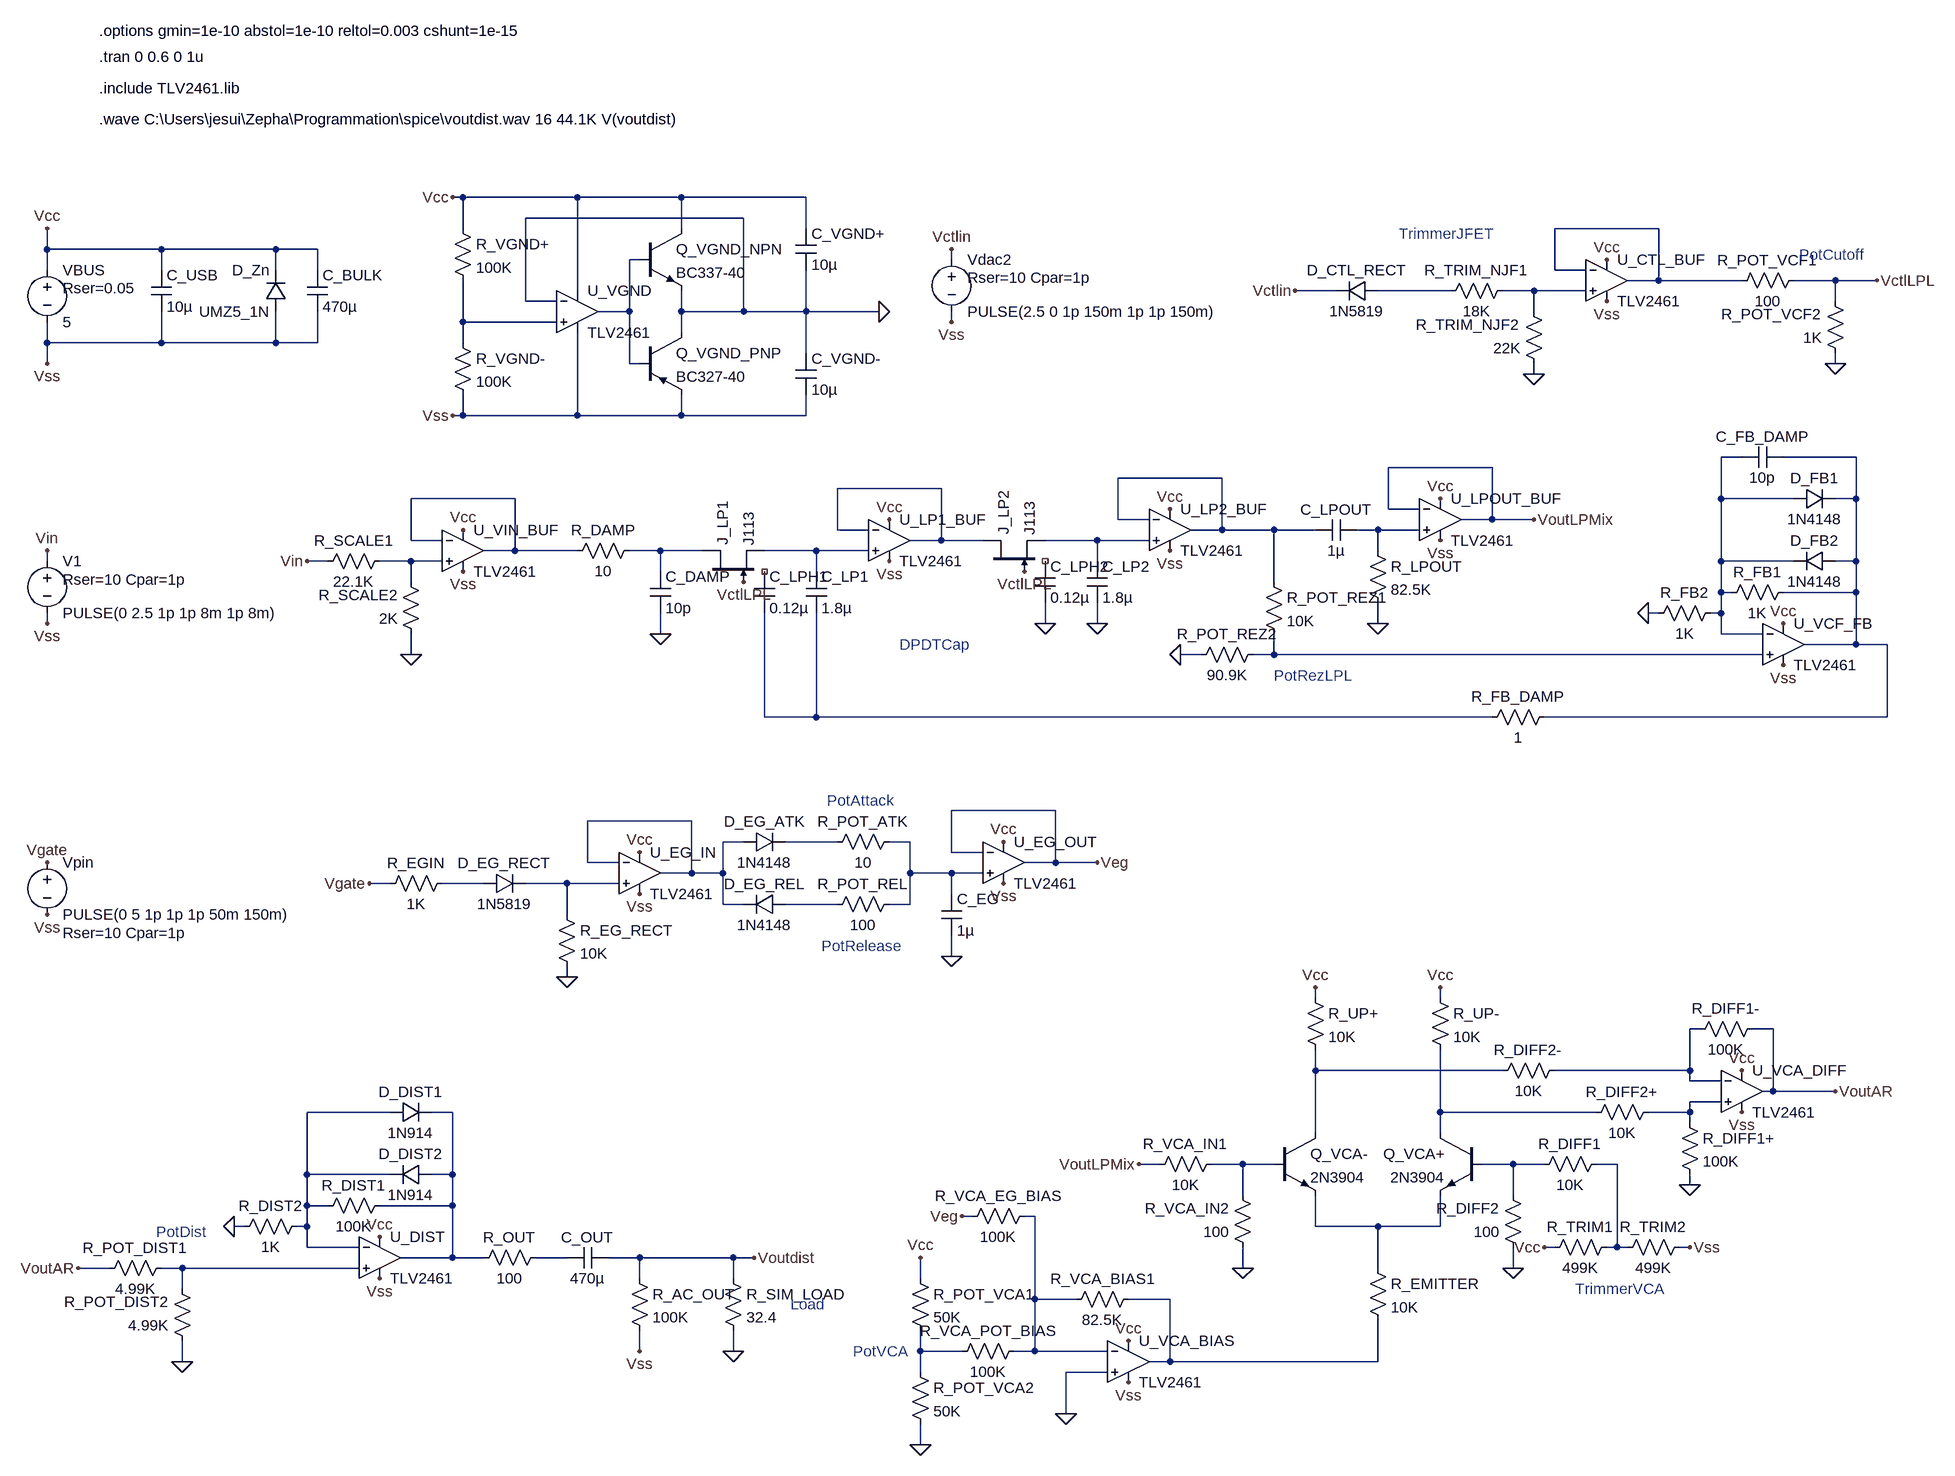
[diagram p0: schematic Heart0.asc]
Heart0.asc, the LTspice schematic file:
Version 4.1
SHEET 1 4584 1604
WIRE 1120 -544 1104 -544
WIRE 1296 -544 1120 -544
WIRE 1456 -544 1296 -544
WIRE 1648 -544 1456 -544
WIRE 1552 -512 1216 -512
WIRE 1120 -496 1120 -544
WIRE 1456 -496 1456 -544
WIRE 1648 -496 1648 -544
WIRE 2960 -496 2800 -496
WIRE 480 -464 480 -496
WIRE 656 -464 480 -464
WIRE 832 -464 656 -464
WIRE 896 -464 832 -464
WIRE 1392 -448 1376 -448
WIRE 1872 -448 1872 -464
WIRE 480 -432 480 -464
WIRE 656 -432 656 -464
WIRE 832 -432 832 -464
WIRE 896 -432 896 -464
WIRE 2800 -432 2800 -496
WIRE 2848 -432 2800 -432
WIRE 2960 -416 2960 -496
WIRE 2960 -416 2912 -416
WIRE 3088 -416 2960 -416
WIRE 3232 -416 3168 -416
WIRE 3296 -416 3232 -416
WIRE 1296 -400 1296 -544
WIRE 2464 -400 2400 -400
WIRE 2640 -400 2528 -400
WIRE 2768 -400 2720 -400
WIRE 2848 -400 2768 -400
WIRE 1216 -384 1216 -512
WIRE 1264 -384 1216 -384
WIRE 3232 -384 3232 -416
WIRE 1376 -368 1376 -448
WIRE 1376 -368 1328 -368
WIRE 1456 -368 1456 -400
WIRE 1552 -368 1552 -512
WIRE 1552 -368 1456 -368
WIRE 1648 -368 1648 -432
WIRE 1648 -368 1552 -368
WIRE 1760 -368 1648 -368
WIRE 2768 -368 2768 -400
WIRE 1120 -352 1120 -416
WIRE 1264 -352 1120 -352
WIRE 1872 -352 1872 -368
WIRE 1456 -336 1456 -368
WIRE 480 -320 480 -352
WIRE 656 -320 656 -368
WIRE 656 -320 480 -320
WIRE 832 -320 832 -368
WIRE 832 -320 656 -320
WIRE 896 -320 896 -368
WIRE 896 -320 832 -320
WIRE 1120 -320 1120 -352
WIRE 1648 -304 1648 -368
WIRE 480 -288 480 -320
WIRE 1376 -288 1376 -368
WIRE 1392 -288 1376 -288
WIRE 3232 -288 3232 -304
WIRE 2768 -272 2768 -288
WIRE 1120 -208 1120 -240
WIRE 1120 -208 1104 -208
WIRE 1296 -208 1296 -336
WIRE 1296 -208 1120 -208
WIRE 1456 -208 1456 -240
WIRE 1456 -208 1296 -208
WIRE 1648 -208 1648 -240
WIRE 1648 -208 1456 -208
WIRE 3088 -144 3056 -144
WIRE 3264 -144 3152 -144
WIRE 2704 -128 2544 -128
WIRE 2288 -112 2128 -112
WIRE 1856 -96 1696 -96
WIRE 1200 -80 1040 -80
WIRE 3056 -80 3056 -144
WIRE 3168 -80 3056 -80
WIRE 3264 -80 3264 -144
WIRE 3264 -80 3232 -80
WIRE 2544 -64 2544 -128
WIRE 2592 -64 2544 -64
WIRE 2128 -48 2128 -112
WIRE 2176 -48 2128 -48
WIRE 2704 -48 2704 -128
WIRE 2704 -48 2656 -48
WIRE 2768 -48 2704 -48
WIRE 1696 -32 1696 -96
WIRE 1744 -32 1696 -32
WIRE 2288 -32 2288 -112
WIRE 2288 -32 2240 -32
WIRE 2368 -32 2288 -32
WIRE 2432 -32 2368 -32
WIRE 2528 -32 2496 -32
WIRE 2592 -32 2528 -32
WIRE 1040 -16 1040 -80
WIRE 1088 -16 1040 -16
WIRE 1856 -16 1856 -96
WIRE 1856 -16 1808 -16
WIRE 1920 -16 1856 -16
WIRE 2096 -16 2016 -16
WIRE 2176 -16 2096 -16
WIRE 1200 0 1200 -80
WIRE 1200 0 1152 0
WIRE 1296 0 1200 0
WIRE 1424 0 1376 0
WIRE 1488 0 1424 0
WIRE 1664 0 1584 0
WIRE 1744 0 1664 0
WIRE 2528 0 2528 -32
WIRE 480 16 480 0
WIRE 912 16 880 16
WIRE 1040 16 992 16
WIRE 1088 16 1040 16
WIRE 2096 16 2096 -16
WIRE 3056 16 3056 -80
WIRE 3168 16 3056 16
WIRE 3264 16 3264 -80
WIRE 3264 16 3232 16
WIRE 1424 32 1424 0
WIRE 1664 32 1664 0
WIRE 1040 48 1040 16
WIRE 2368 48 2368 -32
WIRE 3056 64 3056 16
WIRE 3072 64 3056 64
WIRE 3264 64 3264 16
WIRE 3264 64 3152 64
WIRE 2960 96 2944 96
WIRE 3056 96 3056 64
WIRE 3056 96 3040 96
WIRE 480 112 480 96
WIRE 2016 112 2016 80
WIRE 2096 112 2096 80
WIRE 2528 112 2528 80
WIRE 1424 128 1424 96
WIRE 3056 128 3056 96
WIRE 3120 128 3056 128
WIRE 3264 144 3264 64
WIRE 3264 144 3184 144
WIRE 3312 144 3264 144
WIRE 1040 160 1040 128
WIRE 2256 160 2224 160
WIRE 2368 160 2368 128
WIRE 2368 160 2336 160
WIRE 3120 160 2368 160
WIRE 1584 256 1584 96
WIRE 1664 256 1664 96
WIRE 1664 256 1584 256
WIRE 2704 256 1664 256
WIRE 3312 256 3312 144
WIRE 3312 256 2784 256
WIRE 2032 400 1872 400
WIRE 1472 416 1312 416
WIRE 1552 448 1520 448
WIRE 1696 448 1616 448
WIRE 1808 448 1776 448
WIRE 1872 464 1872 400
WIRE 1920 464 1872 464
WIRE 1312 480 1312 416
WIRE 1360 480 1312 480
WIRE 2032 480 2032 400
WIRE 2032 480 1984 480
WIRE 2096 480 2032 480
WIRE 1472 496 1472 416
WIRE 1472 496 1424 496
WIRE 1520 496 1520 448
WIRE 1520 496 1472 496
WIRE 1808 496 1808 448
WIRE 1872 496 1808 496
WIRE 1920 496 1872 496
WIRE 1008 512 976 512
WIRE 1152 512 1088 512
WIRE 1280 512 1216 512
WIRE 1360 512 1280 512
WIRE 1872 528 1872 496
WIRE 1520 544 1520 496
WIRE 1552 544 1520 544
WIRE 1696 544 1616 544
WIRE 1808 544 1808 496
WIRE 1808 544 1776 544
WIRE 1280 560 1280 512
WIRE 1872 624 1872 592
WIRE 1280 656 1280 640
WIRE 2432 688 2432 672
WIRE 2624 688 2624 672
WIRE 3024 736 3008 736
WIRE 3136 736 3104 736
WIRE 2432 800 2432 768
WIRE 2720 800 2432 800
WIRE 3008 800 3008 736
WIRE 3008 800 2800 800
WIRE 3008 816 3008 800
WIRE 3056 816 3008 816
WIRE 3136 832 3136 736
WIRE 3136 832 3120 832
WIRE 3232 832 3136 832
WIRE 3056 848 3008 848
WIRE 1008 864 880 864
WIRE 1104 864 1072 864
WIRE 2624 864 2624 768
WIRE 2864 864 2624 864
WIRE 3008 864 3008 848
WIRE 3008 864 2944 864
WIRE 3008 880 3008 864
WIRE 2432 896 2432 800
WIRE 2624 896 2624 864
WIRE 2192 944 2160 944
WIRE 2320 944 2272 944
WIRE 2368 944 2320 944
WIRE 2736 944 2688 944
WIRE 2784 944 2736 944
WIRE 2896 944 2864 944
WIRE 880 960 880 864
WIRE 1008 960 880 960
WIRE 1104 960 1104 864
WIRE 1104 960 1072 960
WIRE 3008 976 3008 960
WIRE 2320 992 2320 944
WIRE 2736 992 2736 944
WIRE 880 1008 880 960
WIRE 912 1008 880 1008
WIRE 1104 1008 1104 960
WIRE 1104 1008 992 1008
WIRE 1904 1024 1888 1024
WIRE 2000 1024 1984 1024
WIRE 784 1040 768 1040
WIRE 880 1040 880 1008
WIRE 880 1040 864 1040
WIRE 2432 1040 2432 992
WIRE 2528 1040 2432 1040
WIRE 2624 1040 2624 992
WIRE 2624 1040 2528 1040
WIRE 880 1072 880 1040
WIRE 960 1072 880 1072
WIRE 2800 1072 2784 1072
WIRE 2896 1072 2896 944
WIRE 2896 1072 2880 1072
WIRE 2912 1072 2896 1072
WIRE 3008 1072 2992 1072
WIRE 1104 1088 1104 1008
WIRE 1104 1088 1024 1088
WIRE 1152 1088 1104 1088
WIRE 1280 1088 1232 1088
WIRE 1392 1088 1344 1088
WIRE 1536 1088 1392 1088
WIRE 1568 1088 1536 1088
WIRE 576 1104 528 1104
WIRE 688 1104 656 1104
WIRE 960 1104 688 1104
WIRE 2320 1104 2320 1072
WIRE 2528 1104 2528 1040
WIRE 2736 1104 2736 1072
WIRE 1392 1120 1392 1088
WIRE 1536 1120 1536 1088
WIRE 1824 1120 1824 1088
WIRE 688 1136 688 1104
WIRE 2000 1152 2000 1024
WIRE 2064 1152 2000 1152
WIRE 2208 1152 2144 1152
WIRE 1392 1232 1392 1200
WIRE 1536 1232 1536 1200
WIRE 1824 1232 1824 1200
WIRE 1888 1232 1824 1232
WIRE 2000 1232 2000 1152
WIRE 2000 1232 1968 1232
WIRE 2112 1232 2000 1232
WIRE 688 1248 688 1216
WIRE 2208 1248 2208 1152
WIRE 2208 1248 2176 1248
WIRE 2528 1248 2528 1184
WIRE 2528 1248 2208 1248
WIRE 1824 1264 1824 1232
WIRE 2112 1264 2048 1264
WIRE 2048 1328 2048 1264
WIRE 1824 1376 1824 1344
FLAG 1872 -464 Vctlin
FLAG 480 -496 Vcc
FLAG 976 512 Vgate
FLAG 480 480 Vgate
FLAG 1872 624 0
FLAG 1952 448 Vcc
FLAG 1952 512 Vss
FLAG 2096 480 Veg
FLAG 2320 1104 0
FLAG 2736 1104 0
FLAG 2432 672 Vcc
FLAG 2624 672 Vcc
FLAG 2160 944 VoutLPMix
FLAG 3088 800 Vcc
FLAG 3088 864 Vss
FLAG 3008 976 0
FLAG 2144 1216 Vcc
FLAG 2144 1280 Vss
FLAG 1888 1024 Veg
FLAG 2048 1328 0
FLAG 1824 1376 0
FLAG 1824 1088 Vcc
FLAG 3232 832 VoutAR
FLAG 2224 160 0
FLAG 2208 -64 Vcc
FLAG 2208 0 Vss
FLAG 2944 96 0
FLAG 3152 112 Vcc
FLAG 3152 176 Vss
FLAG 1552 48 VctlLPL
FLAG 880 16 Vin
FLAG 1776 -48 Vcc
FLAG 1776 16 Vss
FLAG 2096 112 0
FLAG 2768 -48 VoutLPMix
FLAG 768 1040 0
FLAG 992 1056 Vcc
FLAG 992 1120 Vss
FLAG 528 1104 VoutAR
FLAG 2768 -272 0
FLAG 2400 -400 Vctlin
FLAG 2784 1072 Vcc
FLAG 3008 1072 Vss
FLAG 2528 112 0
FLAG 2624 -80 Vcc
FLAG 2624 -16 Vss
FLAG 2016 112 0
FLAG 688 1248 0
FLAG 1568 1088 Voutdist
FLAG 480 -288 Vss
FLAG 1760 -368 0
FLAG 1280 656 0
FLAG 1536 1232 0
FLAG 1040 160 0
FLAG 1120 -32 Vcc
FLAG 1120 32 Vss
FLAG 2880 -448 Vcc
FLAG 2880 -384 Vss
FLAG 3232 -288 0
FLAG 480 0 Vin
FLAG 1424 128 0
FLAG 1984 32 VctlLPL
FLAG 3296 -416 VctlLPL
FLAG 1392 464 Vcc
FLAG 1392 528 Vss
FLAG 1104 -544 Vcc
FLAG 1104 -208 Vss
FLAG 480 112 Vss
FLAG 1872 -352 Vss
FLAG 480 560 Vss
FLAG 1392 1232 Vss
SYMBOL voltage 480 -448 R0
WINDOW 123 0 0 Left 0
WINDOW 39 24 44 Left 2
SYMATTR SpiceLine Rser=0.05
SYMATTR InstName VBUS
SYMATTR Value 5
SYMBOL voltage 1872 -464 R0
WINDOW 123 0 0 Left 0
WINDOW 39 24 44 Left 2
SYMATTR SpiceLine Rser=10 Cpar=1p
SYMATTR InstName Vdac2
SYMATTR Value PULSE(2.5 0 1p 150m 1p 1p 150m)
SYMBOL voltage 480 464 R0
WINDOW 123 0 0 Left 0
WINDOW 39 24 124 Left 2
SYMATTR SpiceLine Rser=10 Cpar=1p
SYMATTR InstName Vpin
SYMATTR Value PULSE(0 5 1p 1p 1p 50m 150m)
SYMBOL diode 1552 464 R270
WINDOW 0 32 32 VTop 2
WINDOW 3 0 32 VBottom 2
SYMATTR InstName D_EG_ATK
SYMATTR Value 1N4148
SYMBOL diode 1616 528 R90
WINDOW 0 0 32 VBottom 2
WINDOW 3 32 32 VTop 2
SYMATTR InstName D_EG_REL
SYMATTR Value 1N4148
SYMBOL res 1792 528 R90
WINDOW 0 0 56 VBottom 2
WINDOW 3 32 56 VTop 2
SYMATTR InstName R_POT_REL
SYMATTR Value 100
SYMATTR SpiceLine tol=1 pwr=0.1
SYMBOL res 1792 432 R90
WINDOW 0 0 56 VBottom 2
WINDOW 3 32 56 VTop 2
SYMATTR InstName R_POT_ATK
SYMATTR Value 10
SYMATTR SpiceLine tol=1 pwr=0.1
SYMBOL cap 1856 528 R0
SYMATTR InstName C_EG
SYMATTR Value 1µ
SYMATTR SpiceLine V=6.3 Irms=0 Rser=0.0078 Lser=439p mfg="Würth Elektronik" pn="885012206002 WCAP-CSGP 0603" type="X7R"
SYMBOL npn 2368 896 R0
SYMATTR InstName Q_VCA-
SYMATTR Value 2N3904
SYMBOL npn 2688 896 M0
SYMATTR InstName Q_VCA+
SYMATTR Value 2N3904
SYMBOL res 2288 928 R90
WINDOW 0 0 56 VBottom 2
WINDOW 3 32 56 VTop 2
SYMATTR InstName R_VCA_IN1
SYMATTR Value 10K
SYMATTR SpiceLine tol=1 pwr=0.1
SYMBOL res 2336 1088 R180
WINDOW 0 36 76 Left 2
WINDOW 3 36 40 Left 2
SYMATTR InstName R_VCA_IN2
SYMATTR Value 100
SYMATTR SpiceLine tol=1 pwr=0.1
SYMBOL res 2416 672 R0
SYMATTR InstName R_UP+
SYMATTR Value 10K
SYMATTR SpiceLine tol=1 pwr=0.1
SYMBOL res 2608 672 R0
SYMATTR InstName R_UP-
SYMATTR Value 10K
SYMATTR SpiceLine tol=1 pwr=0.1
SYMBOL res 2880 928 R90
WINDOW 0 0 56 VBottom 2
WINDOW 3 32 56 VTop 2
SYMATTR InstName R_DIFF1
SYMATTR Value 10K
SYMATTR SpiceLine tol=1 pwr=0.1
SYMBOL res 2752 1088 R180
WINDOW 0 36 76 Left 2
WINDOW 3 36 40 Left 2
SYMATTR InstName R_DIFF2
SYMATTR Value 100
SYMATTR SpiceLine tol=1 pwr=0.1
SYMBOL res 2512 1088 R0
SYMATTR InstName R_EMITTER
SYMATTR Value 10K
SYMATTR SpiceLine tol=1 pwr=0.1
SYMBOL res 2960 848 R90
WINDOW 0 0 56 VBottom 2
WINDOW 3 32 56 VTop 2
SYMATTR InstName R_DIFF2+
SYMATTR Value 10K
SYMATTR SpiceLine tol=1 pwr=0.1
SYMBOL res 2816 784 R90
WINDOW 0 0 56 VBottom 2
WINDOW 3 32 56 VTop 2
SYMATTR InstName R_DIFF2-
SYMATTR Value 10K
SYMATTR SpiceLine tol=1 pwr=0.1
SYMBOL res 2992 864 R0
SYMATTR InstName R_DIFF1+
SYMATTR Value 100K
SYMATTR SpiceLine tol=1 pwr=0.1
SYMBOL res 3120 720 R90
WINDOW 0 0 56 VBottom 2
WINDOW 3 32 56 VTop 2
SYMATTR InstName R_DIFF1-
SYMATTR Value 100K
SYMATTR SpiceLine tol=1 pwr=0.1
SYMBOL res 2160 1136 R90
WINDOW 0 0 56 VBottom 2
WINDOW 3 32 56 VTop 2
SYMATTR InstName R_VCA_BIAS1
SYMATTR Value 82.5K
SYMATTR SpiceLine tol=1 pwr=0.1
SYMBOL res 1984 1216 R90
WINDOW 0 0 56 VBottom 2
WINDOW 3 32 56 VTop 2
SYMATTR InstName R_VCA_POT_BIAS
SYMATTR Value 100K
SYMATTR SpiceLine tol=1 pwr=0.1
SYMBOL res 2000 1008 R90
WINDOW 0 0 56 VBottom 2
WINDOW 3 32 56 VTop 2
SYMATTR InstName R_VCA_EG_BIAS
SYMATTR Value 100K
SYMATTR SpiceLine tol=1 pwr=0.1
SYMBOL res 1808 1104 R0
SYMATTR InstName R_POT_VCA1
SYMATTR Value 50K
SYMATTR SpiceLine tol=1 pwr=0.1
SYMBOL res 1808 1248 R0
SYMATTR InstName R_POT_VCA2
SYMATTR Value 50K
SYMATTR SpiceLine tol=1 pwr=0.1
SYMBOL res 3168 48 R90
WINDOW 0 0 56 VBottom 2
WINDOW 3 32 56 VTop 2
SYMATTR InstName R_FB1
SYMATTR Value 1K
SYMATTR SpiceLine tol=1 pwr=0.1
SYMBOL res 2352 32 R0
SYMATTR InstName R_POT_REZ1
SYMATTR Value 10K
SYMATTR SpiceLine tol=1 pwr=0.1
SYMBOL res 2352 144 R90
WINDOW 0 0 56 VBottom 2
WINDOW 3 32 56 VTop 2
SYMATTR InstName R_POT_REZ2
SYMATTR Value 90.9K
SYMATTR SpiceLine tol=1 pwr=0.1
SYMBOL res 3056 80 R90
WINDOW 0 0 56 VBottom 2
WINDOW 3 32 56 VTop 2
SYMATTR InstName R_FB2
SYMATTR Value 1K
SYMATTR SpiceLine tol=1 pwr=0.1
SYMBOL njf 1488 48 R270
SYMATTR InstName J_LP1
SYMATTR Value J113
SYMBOL njf 1920 32 R270
SYMATTR InstName J_LP2
SYMATTR Value J113
SYMBOL cap 1648 32 R0
SYMATTR InstName C_LP1
SYMATTR Value 1.8µ
SYMATTR SpiceLine V=4 Irms=6.26 Rser=0.0135073 Lser=0 mfg="KEMET" pn="C0603C185K7PAC" type="X5R"
SYMBOL cap 2080 16 R0
SYMATTR InstName C_LP2
SYMATTR Value 1.8µ
SYMATTR SpiceLine V=4 Irms=7.41 Rser=0.00578345 Lser=0 mfg="KEMET" pn="C0805C185K7PAC" type="X5R"
SYMBOL diode 3232 0 R90
WINDOW 0 0 32 VBottom 2
WINDOW 3 32 32 VTop 2
SYMATTR InstName D_FB2
SYMATTR Value 1N4148
SYMBOL diode 3168 -64 R270
WINDOW 0 32 32 VTop 2
WINDOW 3 0 32 VBottom 2
SYMATTR InstName D_FB1
SYMATTR Value 1N4148
SYMBOL res 1008 992 R90
WINDOW 0 0 56 VBottom 2
WINDOW 3 32 56 VTop 2
SYMATTR InstName R_DIST1
SYMATTR Value 100K
SYMATTR SpiceLine tol=1 pwr=0.1
SYMBOL res 880 1024 R90
WINDOW 0 0 56 VBottom 2
WINDOW 3 32 56 VTop 2
SYMATTR InstName R_DIST2
SYMATTR Value 1K
SYMATTR SpiceLine tol=1 pwr=0.1
SYMBOL diode 1072 944 R90
WINDOW 0 0 32 VBottom 2
WINDOW 3 32 32 VTop 2
SYMATTR InstName D_DIST2
SYMATTR Value 1N914
SYMBOL diode 1008 880 R270
WINDOW 0 32 32 VTop 2
WINDOW 3 0 32 VBottom 2
SYMATTR InstName D_DIST1
SYMATTR Value 1N914
SYMBOL res 2736 -416 R90
WINDOW 0 0 56 VBottom 2
WINDOW 3 32 56 VTop 2
SYMATTR InstName R_TRIM_NJF1
SYMATTR Value 18K
SYMATTR SpiceLine tol=1 pwr=0.1
SYMBOL res 2784 -272 R180
WINDOW 0 36 76 Left 2
WINDOW 3 36 40 Left 2
SYMATTR InstName R_TRIM_NJF2
SYMATTR Value 22K
SYMATTR SpiceLine tol=1 pwr=0.1
SYMBOL res 2896 1056 R90
WINDOW 0 0 56 VBottom 2
WINDOW 3 32 56 VTop 2
SYMATTR InstName R_TRIM1
SYMATTR Value 499K
SYMATTR SpiceLine tol=1 pwr=0.1
SYMBOL res 3008 1056 R90
WINDOW 0 0 56 VBottom 2
WINDOW 3 32 56 VTop 2
SYMATTR InstName R_TRIM2
SYMATTR Value 499K
SYMATTR SpiceLine tol=1 pwr=0.1
SYMBOL cap 2496 -48 R90
WINDOW 0 0 32 VBottom 2
WINDOW 3 32 32 VTop 2
SYMATTR InstName C_LPOUT
SYMATTR Value 1µ
SYMATTR SpiceLine V=6.3 Irms=0 Rser=0.0122 Lser=339p mfg="Würth Elektronik" pn="885012105006 WCAP-CSGP 0402" type="X5R"
SYMBOL res 2512 -16 R0
SYMATTR InstName R_LPOUT
SYMATTR Value 82.5K
SYMATTR SpiceLine tol=1 pwr=0.1
SYMBOL cap 2000 16 R0
SYMATTR InstName C_LPH2
SYMATTR Value 0.12µ
SYMATTR SpiceLine V=6.3 Irms=3.06 Rser=0.0479709 Lser=0 mfg="KEMET" pn="C0402C124K9PAC" type="X5R"
SYMBOL cap 1568 32 R0
SYMATTR InstName C_LPH1
SYMATTR Value 0.12µ
SYMATTR SpiceLine V=6.3 Irms=3.06 Rser=0.0479709 Lser=0 mfg="KEMET" pn="C0402C124K9PAC" type="X5R"
SYMBOL res 672 1088 R90
WINDOW 0 0 56 VBottom 2
WINDOW 3 32 56 VTop 2
SYMATTR InstName R_POT_DIST1
SYMATTR Value 4.99K
SYMATTR SpiceLine tol=1 pwr=0.1
SYMBOL res 704 1232 R180
WINDOW 0 36 76 Left 2
WINDOW 3 36 40 Left 2
SYMATTR InstName R_POT_DIST2
SYMATTR Value 4.99K
SYMATTR SpiceLine tol=1 pwr=0.1
SYMBOL cap 1344 1072 R90
WINDOW 0 0 32 VBottom 2
WINDOW 3 32 32 VTop 2
SYMATTR InstName C_OUT
SYMATTR Value 470µ
SYMATTR SpiceLine V=2 Irms=3.87298 Rser=0.015 Lser=0 mfg="KEMET" pn="A700X477M002ATE015" type="Al electrolytic"
SYMBOL res 1248 1072 R90
WINDOW 0 0 56 VBottom 2
WINDOW 3 32 56 VTop 2
SYMATTR InstName R_OUT
SYMATTR Value 100
SYMATTR SpiceLine tol=1 pwr=0.1
SYMBOL npn 1392 -496 R0
SYMATTR InstName Q_VGND_NPN
SYMATTR Value BC337-40
SYMBOL pnp 1392 -336 R0
SYMATTR InstName Q_VGND_PNP
SYMATTR Value BC327-40
SYMBOL diode 1152 528 R270
WINDOW 0 32 32 VTop 2
WINDOW 3 0 32 VBottom 2
SYMATTR InstName D_EG_RECT
SYMATTR Value 1N5819
SYMBOL res 1264 544 R0
SYMATTR InstName R_EG_RECT
SYMATTR Value 10K
SYMATTR SpiceLine tol=1 pwr=0.1
SYMBOL res 1520 1104 R0
SYMATTR InstName R_SIM_LOAD
SYMATTR Value 32.4
SYMATTR SpiceLine tol=1 pwr=0.1
SYMBOL diode 848 -368 R180
WINDOW 0 24 64 Left 2
WINDOW 3 24 0 Left 2
SYMATTR InstName D_Zn
SYMATTR Value UMZ5_1N
SYMBOL cap 640 -432 R0
SYMATTR InstName C_USB
SYMATTR Value 10µ
SYMATTR SpiceLine V=6.3 Irms=0 Rser=0.0026 Lser=750p mfg="Würth Elektronik" pn="885012208003 WCAP-CSGP 1206" type="X7R"
SYMBOL cap 880 -432 R0
SYMATTR Value 470µ
SYMATTR InstName C_BULK
SYMATTR SpiceLine V=2 Irms=3.5 Rser=0.007 Lser=0 mfg="Rubycon" pn="2SW470M" type="Al electrolytic"
SYMBOL res 1008 0 R90
WINDOW 0 0 56 VBottom 2
WINDOW 3 32 56 VTop 2
SYMATTR InstName R_SCALE1
SYMATTR Value 22.1K
SYMATTR SpiceLine tol=1 pwr=0.1
SYMBOL res 1056 144 R180
WINDOW 0 36 76 Left 2
WINDOW 3 36 40 Left 2
SYMATTR InstName R_SCALE2
SYMATTR Value 2K
SYMATTR SpiceLine tol=1 pwr=0.1
SYMBOL res 3072 -400 R270
WINDOW 0 32 56 VTop 2
WINDOW 3 0 56 VBottom 2
SYMATTR InstName R_POT_VCF1
SYMATTR Value 100
SYMATTR SpiceLine tol=1 pwr=0.1
SYMBOL res 3248 -288 R180
WINDOW 0 36 76 Left 2
WINDOW 3 36 40 Left 2
SYMATTR InstName R_POT_VCF2
SYMATTR Value 1K
SYMATTR SpiceLine tol=1 pwr=0.1
SYMBOL voltage 480 0 R0
WINDOW 123 0 0 Left 0
WINDOW 39 24 44 Left 2
SYMATTR SpiceLine Rser=10 Cpar=1p
SYMATTR InstName V1
SYMATTR Value PULSE(0 2.5 1p 1p 8m 1p 8m)
SYMBOL res 1392 -16 R90
WINDOW 0 0 56 VBottom 2
WINDOW 3 32 56 VTop 2
SYMATTR InstName R_DAMP
SYMATTR Value 10
SYMATTR SpiceLine tol=1 pwr=0.1
SYMBOL cap 1408 32 R0
SYMATTR InstName C_DAMP
SYMATTR Value 10p
SYMATTR SpiceLine V=25 Irms=0 Rser=0.6361 Lser=220p mfg="Würth Elektronik" pn="885012004004 WCAP-CSGP 0201" type="NP0"
SYMBOL cap 3152 -160 R90
WINDOW 0 0 32 VBottom 2
WINDOW 3 32 32 VTop 2
SYMATTR InstName C_FB_DAMP
SYMATTR Value 10p
SYMATTR SpiceLine V=10 Irms=0 Rser=0.668 Lser=560p mfg="Würth Elektronik" pn="885012006002 WCAP-CSGP 0603" type="NP0"
SYMBOL res 2800 240 R90
WINDOW 0 0 56 VBottom 2
WINDOW 3 32 56 VTop 2
SYMATTR InstName R_FB_DAMP
SYMATTR Value 1
SYMATTR SpiceLine tol=1 pwr=0.1
SYMBOL diode 2528 -416 R90
WINDOW 0 0 32 VBottom 2
WINDOW 3 32 32 VTop 2
SYMATTR InstName D_CTL_RECT
SYMATTR Value 1N5819
SYMBOL res 1104 -336 R0
SYMATTR InstName R_VGND-
SYMATTR Value 100K
SYMATTR SpiceLine tol=1 pwr=0.1
SYMBOL res 1104 -512 R0
SYMATTR InstName R_VGND+
SYMATTR Value 100K
SYMATTR SpiceLine tol=1 pwr=0.1
SYMBOL res 1104 496 R90
WINDOW 0 0 56 VBottom 2
WINDOW 3 32 56 VTop 2
SYMATTR InstName R_EGIN
SYMATTR Value 1K
SYMBOL OpAmps\\opamp2 1296 -432 R0
SYMATTR InstName U_VGND
SYMATTR Value TLV2461
SYMBOL OpAmps\\opamp2 3088 768 R0
SYMATTR InstName U_VCA_DIFF
SYMATTR Value TLV2461
SYMBOL OpAmps\\opamp2 2624 -112 R0
SYMATTR InstName U_LPOUT_BUF
SYMATTR Value TLV2461
SYMBOL OpAmps\\opamp2 2208 -96 R0
SYMATTR InstName U_LP2_BUF
SYMATTR Value TLV2461
SYMBOL OpAmps\\opamp2 1776 -80 R0
SYMATTR InstName U_LP1_BUF
SYMATTR Value TLV2461
SYMBOL OpAmps\\opamp2 1120 -64 R0
SYMATTR InstName U_VIN_BUF
SYMATTR Value TLV2461
SYMBOL cap 1632 -496 R0
SYMATTR Value 10µ
SYMATTR InstName C_VGND+
SYMATTR SpiceLine V=6.3 Irms=15m Rser=2.8021 Lser=879p mfg="Würth Elektronik" pn="865250140001 WCAP-ASNP 4x5,5" type="Al electrolytic"
SYMBOL cap 1632 -304 R0
SYMATTR Value 10µ
SYMATTR InstName C_VGND-
SYMATTR SpiceLine V=10 Irms=23m Rser=2.4699 Lser=942p mfg="Würth Elektronik" pn="865090240001 WCAP-ASLU 4x5,5" type="Al electrolytic"
SYMBOL OpAmps\\opamp2 3152 80 R0
SYMATTR InstName U_VCF_FB
SYMATTR Value TLV2461
SYMBOL OpAmps\\opamp2 1392 432 R0
SYMATTR InstName U_EG_IN
SYMATTR Value TLV2461
SYMBOL OpAmps\\opamp2 1952 416 R0
SYMATTR InstName U_EG_OUT
SYMATTR Value TLV2461
SYMBOL OpAmps\\opamp2 2144 1184 R0
SYMATTR InstName U_VCA_BIAS
SYMATTR Value TLV2461
SYMBOL OpAmps\\opamp2 992 1024 R0
SYMATTR InstName U_DIST
SYMATTR Value TLV2461
SYMBOL OpAmps\\opamp2 2880 -480 R0
SYMATTR InstName U_CTL_BUF
SYMATTR Value TLV2461
SYMBOL res 1376 1104 R0
SYMATTR InstName R_AC_OUT
SYMATTR Value 100K
SYMATTR SpiceLine tol=1 pwr=0.1
TEXT 560 -760 Left 2 !.tran 0 0.6 0 1u
TEXT 560 -712 Left 2 !.include TLV2461.lib
TEXT 560 -664 Left 2 !.wave C:\\Users\\jesui\\Zepha\\Programmation\\spice\\voutdist.wav 16 44.1K V(voutdist)
TEXT 2368 192 Left 2 ;PotRezLPL
TEXT 2560 -488 Left 2 ;TrimmerJFET
TEXT 1680 384 Left 2 ;PotAttack
TEXT 1672 608 Left 2 ;PotRelease
TEXT 1720 1232 Left 2 ;PotVCA
TEXT 2832 1136 Left 2 ;TrimmerVCA
TEXT 648 1048 Left 2 ;PotDist
TEXT 1792 144 Left 2 ;DPDTCap
TEXT 1624 1160 Left 2 ;Load
TEXT 3176 -456 Left 2 ;PotCutoff
TEXT 560 -800 Left 2 !.options gmin=1e-10 abstol=1e-10 reltol=0.003 cshunt=1e-15

The netlist it stands for:
* Heart0.asc
VBUS Vcc Vss 5 Rser=0.05
Vdac2 Vctlin Vss PULSE(2.5 0 1p 150m 1p 1p 150m) Rser=10 Cpar=1p
Vpin Vgate Vss PULSE(0 5 1p 1p 1p 50m 150m) Rser=10 Cpar=1p
D_EG_ATK N018 N019 1N4148
D_EG_REL N023 N018 1N4148
R_POT_REL N020 N023 100 tol=1 pwr=0.1
R_POT_ATK N020 N019 10 tol=1 pwr=0.1
C_EG N020 0 1µ V=6.3 Irms=0 Rser=0.0078 Lser=439p mfg="Würth Elektronik" pn="885012206002 WCAP-CSGP 0603" type="X7R"
Q_VCA- N025 N030 N034 0 2N3904
Q_VCA+ N029 N031 N034 0 2N3904
R_VCA_IN1 N030 VoutLPMix 10K tol=1 pwr=0.1
R_VCA_IN2 0 N030 100 tol=1 pwr=0.1
R_UP+ Vcc N025 10K tol=1 pwr=0.1
R_UP- Vcc N029 10K tol=1 pwr=0.1
R_DIFF1 N032 N031 10K tol=1 pwr=0.1
R_DIFF2 0 N031 100 tol=1 pwr=0.1
R_EMITTER N034 N037 10K tol=1 pwr=0.1
R_DIFF2+ N026 N029 10K tol=1 pwr=0.1
R_DIFF2- N024 N025 10K tol=1 pwr=0.1
R_DIFF1+ N026 0 100K tol=1 pwr=0.1
R_DIFF1- VoutAR N024 100K tol=1 pwr=0.1
R_VCA_BIAS1 N037 N033 82.5K tol=1 pwr=0.1
R_VCA_POT_BIAS N033 N038 100K tol=1 pwr=0.1
R_VCA_EG_BIAS N033 Veg 100K tol=1 pwr=0.1
R_POT_VCA1 Vcc N038 50K tol=1 pwr=0.1
R_POT_VCA2 N038 0 50K tol=1 pwr=0.1
R_FB1 N007 N006 1K tol=1 pwr=0.1
R_POT_REZ1 N008 N016 10K tol=1 pwr=0.1
R_POT_REZ2 N016 0 90.9K tol=1 pwr=0.1
R_FB2 N006 0 1K tol=1 pwr=0.1
J_LP1 N013 VctlLPL N014 J113
J_LP2 N009 VctlLPL N012 J113
C_LP1 N014 N017 1.8µ V=4 Irms=6.26 Rser=0.0135073 Lser=0 mfg="KEMET" pn="C0603C185K7PAC" type="X5R"
C_LP2 N012 0 1.8µ V=4 Irms=7.41 Rser=0.00578345 Lser=0 mfg="KEMET" pn="C0805C185K7PAC" type="X5R"
D_FB2 N007 N006 1N4148
D_FB1 N006 N007 1N4148
R_DIST1 N028 N027 100K tol=1 pwr=0.1
R_DIST2 N027 0 1K tol=1 pwr=0.1
D_DIST2 N028 N027 1N914
D_DIST1 N027 N028 1N914
R_TRIM_NJF1 N004 N003 18K tol=1 pwr=0.1
R_TRIM_NJF2 0 N004 22K tol=1 pwr=0.1
R_TRIM1 N032 Vcc 499K tol=1 pwr=0.1
R_TRIM2 Vss N032 499K tol=1 pwr=0.1
C_LPOUT N011 N008 1µ V=6.3 Irms=0 Rser=0.0122 Lser=339p mfg="Würth Elektronik" pn="885012105006 WCAP-CSGP 0402" type="X5R"
R_LPOUT N011 0 82.5K tol=1 pwr=0.1
C_LPH2 NC_01 0 0.12µ V=6.3 Irms=3.06 Rser=0.0479709 Lser=0 mfg="KEMET" pn="C0402C124K9PAC" type="X5R"
C_LPH1 NC_02 N017 0.12µ V=6.3 Irms=3.06 Rser=0.0479709 Lser=0 mfg="KEMET" pn="C0402C124K9PAC" type="X5R"
R_POT_DIST1 N036 VoutAR 4.99K tol=1 pwr=0.1
R_POT_DIST2 0 N036 4.99K tol=1 pwr=0.1
C_OUT Voutdist N035 470µ V=2 Irms=3.87298 Rser=0.015 Lser=0 mfg="KEMET" pn="A700X477M002ATE015" type="Al electrolytic"
R_OUT N035 N028 100 tol=1 pwr=0.1
Q_VGND_NPN Vcc N002 0 0 BC337-40
Q_VGND_PNP 0 N002 Vss 0 BC327-40
D_EG_RECT N021 N022 1N5819
R_EG_RECT N022 0 10K tol=1 pwr=0.1
R_SIM_LOAD Voutdist 0 32.4 tol=1 pwr=0.1
D_Zn Vss Vcc UMZ5_1N
C_USB Vcc Vss 10µ V=6.3 Irms=0 Rser=0.0026 Lser=750p mfg="Würth Elektronik" pn="885012208003 WCAP-CSGP 1206" type="X7R"
C_BULK Vcc Vss 470µ V=2 Irms=3.5 Rser=0.007 Lser=0 mfg="Rubycon" pn="2SW470M" type="Al electrolytic"
R_SCALE1 N015 Vin 22.1K tol=1 pwr=0.1
R_SCALE2 0 N015 2K tol=1 pwr=0.1
R_POT_VCF1 N001 VctlLPL 100 tol=1 pwr=0.1
R_POT_VCF2 0 VctlLPL 1K tol=1 pwr=0.1
V1 Vin Vss PULSE(0 2.5 1p 1p 8m 1p 8m) Rser=10 Cpar=1p
R_DAMP N013 N010 10 tol=1 pwr=0.1
C_DAMP N013 0 10p V=25 Irms=0 Rser=0.6361 Lser=220p mfg="Würth Elektronik" pn="885012004004 WCAP-CSGP 0201" type="NP0"
C_FB_DAMP N007 N006 10p V=10 Irms=0 Rser=0.668 Lser=560p mfg="Würth Elektronik" pn="885012006002 WCAP-CSGP 0603" type="NP0"
R_FB_DAMP N007 N017 1 tol=1 pwr=0.1
D_CTL_RECT N003 Vctlin 1N5819
R_VGND- N005 Vss 100K tol=1 pwr=0.1
R_VGND+ Vcc N005 100K tol=1 pwr=0.1
R_EGIN N021 Vgate 1K
X§U_VGND N005 0 Vcc Vss N002 TLV2461  ; pins In+ In- V+ V- OUT
X§U_VCA_DIFF N026 N024 Vcc Vss VoutAR TLV2461  ; pins In+ In- V+ V- OUT
X§U_LPOUT_BUF N011 VoutLPMix Vcc Vss VoutLPMix TLV2461  ; pins In+ In- V+ V- OUT
X§U_LP2_BUF N012 N008 Vcc Vss N008 TLV2461  ; pins In+ In- V+ V- OUT
X§U_LP1_BUF N014 N009 Vcc Vss N009 TLV2461  ; pins In+ In- V+ V- OUT
X§U_VIN_BUF N015 N010 Vcc Vss N010 TLV2461  ; pins In+ In- V+ V- OUT
C_VGND+ Vcc 0 10µ V=6.3 Irms=15m Rser=2.8021 Lser=879p mfg="Würth Elektronik" pn="865250140001 WCAP-ASNP 4x5,5" type="Al electrolytic"
C_VGND- 0 Vss 10µ V=10 Irms=23m Rser=2.4699 Lser=942p mfg="Würth Elektronik" pn="865090240001 WCAP-ASLU 4x5,5" type="Al electrolytic"
X§U_VCF_FB N016 N006 Vcc Vss N007 TLV2461  ; pins In+ In- V+ V- OUT
X§U_EG_IN N022 N018 Vcc Vss N018 TLV2461  ; pins In+ In- V+ V- OUT
X§U_EG_OUT N020 Veg Vcc Vss Veg TLV2461  ; pins In+ In- V+ V- OUT
X§U_VCA_BIAS 0 N033 Vcc Vss N037 TLV2461  ; pins In+ In- V+ V- OUT
X§U_DIST N036 N027 Vcc Vss N028 TLV2461  ; pins In+ In- V+ V- OUT
X§U_CTL_BUF N004 N001 Vcc Vss N001 TLV2461  ; pins In+ In- V+ V- OUT
R_AC_OUT Voutdist Vss 100K tol=1 pwr=0.1
.model D D
.lib standard.dio
.model NPN NPN
.model PNP PNP
.lib standard.bjt
.model NJF NJF
.model PJF PJF
.lib standard.jft
.tran 0 0.6 0 1u
.include TLV2461.lib
.wave C:\Users\jesui\Zepha\Programmation\spice\voutdist.wav 16 44.1K V(voutdist)
* PotRezLPL
* TrimmerJFET
* PotAttack
* PotRelease
* PotVCA
* TrimmerVCA
* PotDist
* DPDTCap
* Load
* PotCutoff
.options gmin=1e-10 abstol=1e-10 reltol=0.003 cshunt=1e-15
.backanno
.end